# Altium schematic sheet Power.SchDoc: Main power 5V / 3V3
size A4; Date: Not used; ApprovedBy: Not used; CheckedBy: Not used; Author: Not used; CompanyName: STMicroelectronics; DrawnBy: Not used; Engineer: Not used; Organization: Not used; Address1: Not used; Address2: Not used; Address3: Not used; Address4: Not used; DocumentNumber: 6; Revision: Not used; SheetNumber: 6; SheetTotal: 8; CurrentTime: Not used; CurrentDate: Not used; Time: Not used; DocumentFullPathAndName: Not used; DocumentName: Not used; ModifiedDate: Not used; ImagePath: Not used; ProjectName: Not used; Application_BuildNumber: Not used
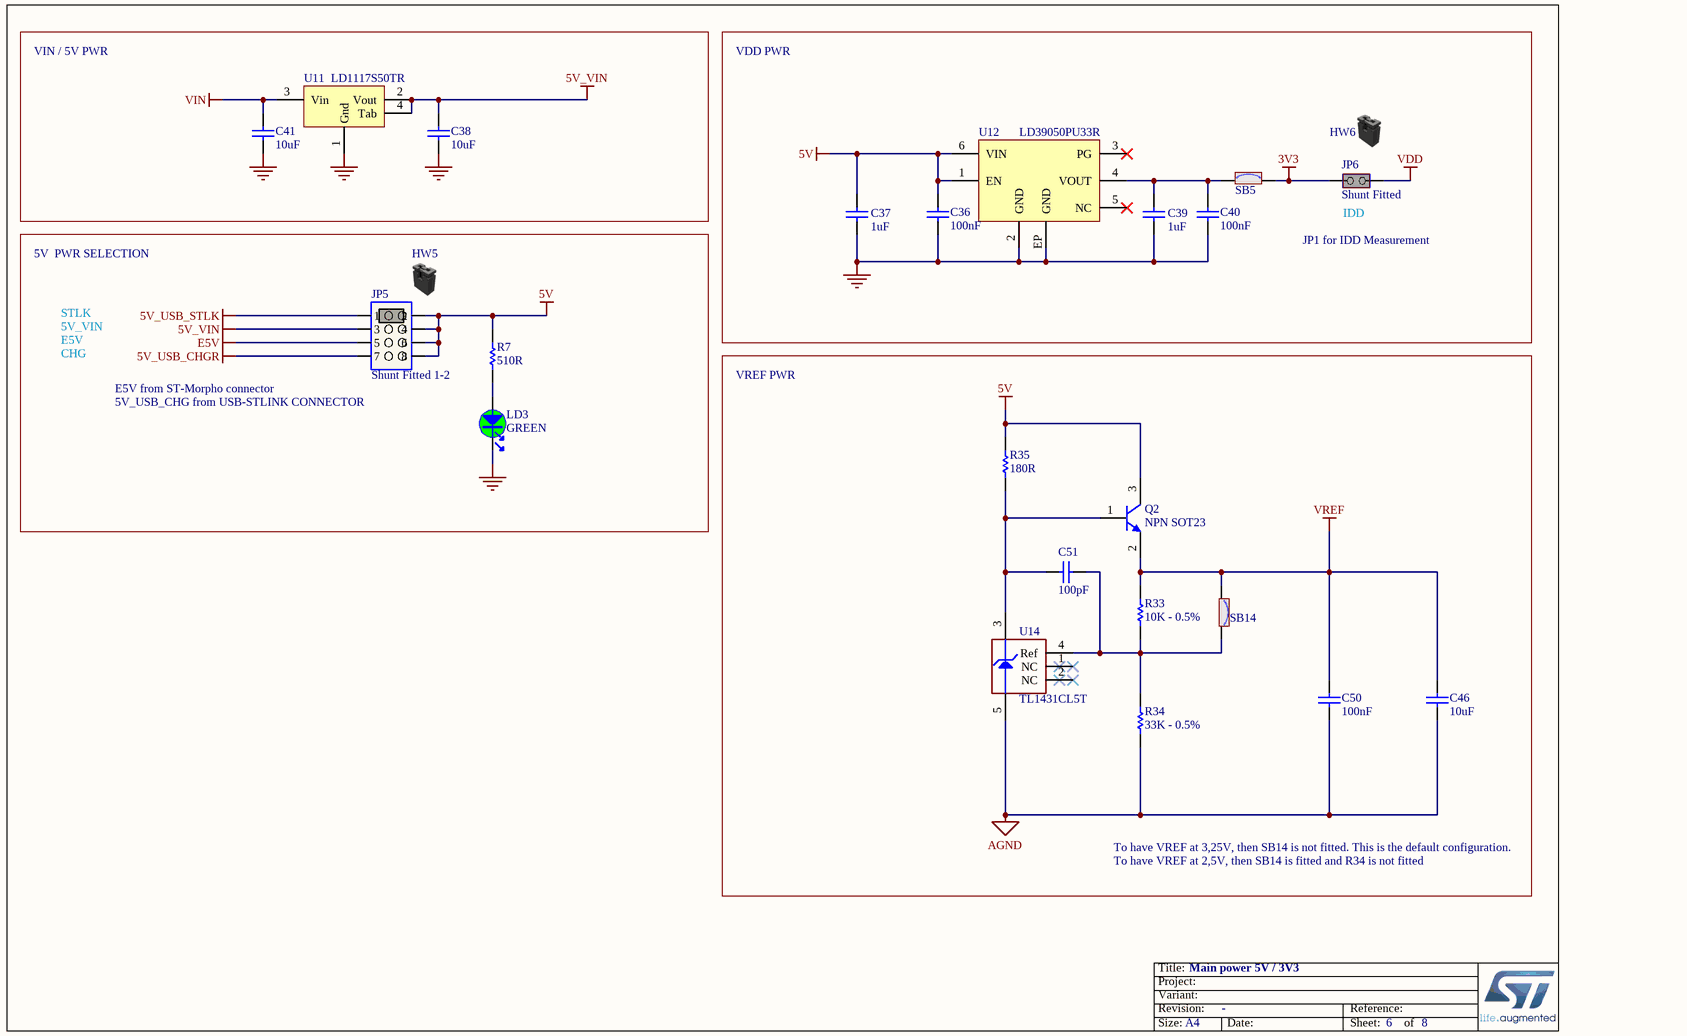
[diagram p0: Power.SchDoc]

## Parts
C36  value 100nF  [C0402]
C37  value 1uF  [C0603]
C38  value 10uF  [C0805]
C39  value 1uF  [C0603]
C40  value 100nF  [C0402]
C41  value 10uF  [C0805]
C46  value 10uF  [C0603]
C50  value 100nF  [C0603]
C51  value 100pF  [C0603]
HW5  (no value)  (mechanical)
HW6  (no value)  (mechanical)
JP5  value Shunt Fitted 1-2  [CON_SAMTEC_TSW-104-07-X-D]
JP6  Shunt Fitted  [CON_SAMTEC_TSW-102-07-G-S]
LD3  value GREEN  [LED_0603_GREEN]
Q2  value NPN SOT23  [NPN_SOT23]
R7  value 510R  [R0603]
R33  value 10K - 0.5%  [R0603]
R34  value 33K - 0.5%  [R0603]
R35  value 180R  [R0603]
SB5  (no value)  [SOLDER-BRIDGE_R0603-0R]
SB14  (no value)  [SOLDER-BRIDGE_R0603-0R]
U11  value LD1117S50TR  [REG_SOT223-TAB]
U12  value LD39050PU33R  [ICC_DFN6-EPAD_3X3_P095]
U14  value TL1431CL5T  [ICC_SOT23-5L_H1P45]

## Blocks framed on the sheet
VIN / 5V PWR: C38 C41 U11
VREF PWR: C46 C50 C51 Q2 R33-R35 SB14 U14

## Nets
3V3: JP6.1(COMMON) SB5.2
5V: C36.2 C37.2 JP5.2 JP5.4 JP5.6 JP5.8 Q2.3(C) R7.2 R35.2 U12.1(EN) U12.6(VIN)
5V_USB_CHGR: JP5.7
5V_USB_STLK: JP5.1
5V_VIN: C38.2 JP5.3 U11.2(Vout) U11.4(Tab)
AGND: C46.1 C50.1 R34.1 U14.5(Anode)
E5V: JP5.5
GND: C36.1 C37.1 C38.1 C39.1 C40.1 C41.1 LD3.2 U11.1(Gnd) U12.2(GND) U12.EP(GND)
VDD: JP6.2(NO)
VIN: C41.2 U11.3(Vin)
VREF: C46.2 C50.2 Q2.2(E) R33.2 SB14.1
NetC39_2: C39.2 C40.2 SB5.1 U12.4(VOUT)
NetC51_1: C51.1 Q2.1(B) R35.1 U14.3(Cathode)
NetC51_2: C51.2 R33.1 R34.2 SB14.2 U14.4(Ref)
NetLD3_1: LD3.1 R7.1

Not connected (* = marked no-connect by the designer): U12 3(PG)* 5(NC)*; U14 1(NC)* 2(NC)*

## Notes on the sheet
- VDD PWR
- JP1 for IDD Measurement
- (near JP6) IDD
- 5V  PWR SELECTION
- STLK
- E5V
- 5V_VIN
- CHG
- E5V from ST-Morpho connector
- 5V_USB_CHG from USB-STLINK CONNECTOR
- To have VREF at 3,25V, then SB14 is not fitted. This is the default configuration.
- To have VREF at 2,5V, then SB14 is fitted and R34 is not fitted
- Title:
- Project:
- Size:
- Revision:
- Variant:
- A4
- -
- Date:
- Reference:
- Sheet:
- of

## Library data of the parts
C36 C40 = MCD-00102: Capacitor, MLCC, 100nF, 16V, X7R, 10%, 0402, T=0,5mm; Manufacturer_Part_Number: CC0402KRX7R7BB104; Manufacturer: YAGEO; Provided_By: Subcon; Initial_Board_Reference: MB1262; Internal_Part_Number: MCD-00102; Status: Released; Package: C0402; ComponentLink1Description: Yageo_Capacitor_X7R-series.pdf; ECCN_US: n/a; ECCN_EU: n/a; Part_Type: Capacitor; ComponentLink1URL: http://tunmcdsvn.tun.st.com/Component_Datasheet_Library/Trunk/Capacitors/Yageo_Multilayer_Capacitor_X7R_series_100pF_to_22uF
C37 C39 = MCD-00010: Capacitor, MLCC, 1uF, 16V, X5R, 10%, 0603, T=0,8mm; Manufacturer_Part_Number: CC0603KRX5R7BB105; Manufacturer: YAGEO; Provided_By: Subcon; Initial_Board_Reference: MB1274; Internal_Part_Number: MCD-00010; Status: Released; Package: C0603; ComponentLink1Description: Yageo_Capacitor_X5R-series.pdf; ECCN_US: n/a; ECCN_EU: n/a; Part_Type: Capacitor; ComponentLink1URL: http://tunmcdsvn.tun.st.com/Component_Datasheet_Library/Trunk/Capacitors/Yageo_Multilayer_capacitor_X5R_series_100pF_to_100uF
C38 C41 = MCD-00014: Capacitor, MLCC, 10uF, 25V, X5R, 10%, 0805, T=0,85mm; Manufacturer_Part_Number: CC0805KRX5R8BB106; Manufacturer: YAGEO; ECCN_US: EAR99; ECCN_EU: NEC; Provided_By: SUBCO; Internal_Part_Number: MCD-00014; ComponentLink1Description: Datasheet; Status: Released; Part_Type: Capacitor; Package: C0805; ComponentLink1URL: http://tunmcdsvn.tun.st.com/Component_Datasheet_Library/Trunk/Capacitors/Yageo_Multilayer_capacitor_X5R_series_100pF_to_100uF
C46 = MCD-01124: Capacitor, MLCC, 10uF, 10V, X5R, 10%, 0603, T=0.8mm; Manufacturer_Part_Number: GRM188R61A106KAAL; Manufacturer: MURATA; ECCN_US: EAR99; ECCN_EU: NEC; Provided_By: SUBCO; Internal_Part_Number: MCD-01124; Status: Released; Part_Type: Capacitor; Package: C0603; ComponentLink1Description: Datasheet; ComponentLink1URL: http://tunmcdsvn.tun.st.com/Component_Datasheet_Library/Trunk/Capacitors/Murata_Capacitor_GR_series
C50 = MCD-00211: Capacitor, MLCC, 100nF, 16V, X7R, 10%, 0603, T=0,8mm; Manufacturer_Part_Number: CC0603KRX7R7BB104; Manufacturer: YAGEO; ECCN_US: EAR99; ECCN_EU: NEC; Provided_By: SUBCO; Internal_Part_Number: MCD-00211; Status: Released; Part_Type: Capacitor; Package: C0603; ComponentLink1Description: Datasheet; ComponentLink1URL: http://tunmcdsvn.tun.st.com/Component_Datasheet_Library/Trunk/Capacitors/Yageo_Multilayer_Capacitor_X7R_series_100pF_to_22uF
C51 = MCD-01101: Capacitor,100pF,50V,X7R,10%,0603; Manufacturer_Part_Number: 06035C101JAT4A; Manufacturer: AVX; ECCN_US: EAR99; ECCN_EU: NEC; Provided_By: SUBCO; Internal_Part_Number: MCD-01101; Status: Checked; Part_Type: Capacitor; Package: C0603; ComponentLink1Description: Datasheet; ComponentLink1URL: http://tunmcdsvn.tun.st.com/Component_Datasheet_Library/Trunk/Capacitors/AVX_Capacitor_X7R-series/AVX_X7R-series.pdf; Alternate_Manufacturer_Part_Number: N/A; Alternate_Manufacturer: N/A; Order_Code_Digikey: 06035C101JAT4A-ND; Order_Code_Farnell: N/A; Order_Code_RS: N/A; BMS_Part_Number: N/A
HW5 HW6 = MCD-00043: SHUNT 2.54mm BLACK; Manufacturer_Part_Number: SNT-100-BK-G; Manufacturer: SAMTEC; Part_Type: Mechanical; Provided_By: Subcon; Initial_Board_Reference: MB1274; Internal_Part_Number: MCD-00043; ECCN_US: n/a; ECCN_EU: n/a; ComponentLink1Description: Samtec_Shunt_Jumper_SNT100.pdf; Status: Released; ComponentLink1URL: http://tunmcdsvn.tun.st.com/Component_Datasheet_Library/Trunk/Connectors/Samtec_Shunt_Jumper_SNT100
JP5 = MCD-00686: Header, 4x2, 2,54mm, VR, TH, Height 5.84mm/2.54mm - Shunt Fitted 1-2; Part_Type: Connector; Manufacturer_Part_Number: TSW-104-07-x-D; Manufacturer: SAMTEC; Provided_By: SUBCO; Internal_Part_Number: MCD-00686; Status: Released; ComponentLink1Description: Datasheet; ComponentLink1URL: http://tunmcdsvn.tun.st.com/Component_Datasheet_Library/Trunk/Connectors/Samtec_TSW-HTSW-series; ECCN_US: n/a; ECCN_EU: n/a
JP6 = MCD-00683: Header, 2x1, 2,54mm, VR, TH, Height 5.84mm/2.54mm - Shunt Fitted by default; Part_Type: Connector; Manufacturer_Part_Number: TSW-102-07-x-S; Manufacturer: SAMTEC; Provided_By: Subcon; Initial_Board_Reference: MB1331; Internal_Part_Number: MCD-00683; Value: Shunt Fitted; Status: Released; ComponentLink1Description: Samtec_connector_TSW-HTSW-series.pdf; ComponentLink1URL: http://tunmcdsvn.tun.st.com/Component_Datasheet_Library/Trunk/Connectors/Samtec_TSW-HTSW-series; ECCN_US: n/a; ECCN_EU: n/a
LD3 = MCD-00050: LED, Green, 0603; Manufacturer_Part_Number: 19-213SYGC/S530-E2/TR8; Manufacturer: EVERLIGHT; Part_Type: Display; ECCN_US: EAR99; ECCN_EU: NEC; Provided_By: SUBCO; Internal_Part_Number: MCD-00050; ComponentLink1Description: Datasheet; Status: Released; ComponentLink1URL: http://tunmcdsvn.tun.st.com/Component_Datasheet_Library/Trunk/Display/Everlight_SMD-LED-GREEN_19-213SYGC-S530-XX-TR8-v3.doc; Package: LED 0603
Q2 = MCD-00073: NPN Bipolar Transistor; Part_Type: IC; Manufacturer_Part_Number: BSR14; Manufacturer: ON SEMICONDUCTOR; Alternate_Manufacturer_Part_Number: MMBT2222LT1G / MMBT2222ALT1G / MMBT2222ALT3G; ECCN_US: EAR99; ECCN_EU: NEC; Provided_By: SUBCO; Revision: *; Internal_Part_Number: MCD-00073; Status: Released; ComponentLink1Description: Datasheet; ComponentLink1URL: http://tunmcdsvn.tun.st.com/Component_Datasheet_Library/Trunk/IC/NXP_Transistor_BSR14; Alternate_Manufacturer: ON SEMICONDUCTOR; Package: SOT23
R7 = MCD-00225: Resistor,510R,0603,1%,1/10W; Manufacturer_Part_Number: RC0603FR-07510RL; Manufacturer: YAGEO; ECCN_US: EAR99; ECCN_EU: NEC; Provided_By: SUBCO; Internal_Part_Number: MCD-00225; ComponentLink1Description: Datasheet; Status: Released; Part_Type: Resistor; Package: R0603; ComponentLink1URL: http://tunmcdsvn.tun.st.com/Component_Datasheet_Library/Trunk/Resistors/Yageo_Resistor_RC0603-series
R33 = MCD-01215: resistor, 10K, 0603, 0.5%, 1/10W; Manufacturer_Part_Number: RC0603DR-0710KL; Manufacturer: YAGEO; ECCN_US: EAR99; ECCN_EU: NEC; Provided_By: SUBCO; Internal_Part_Number: MCD-01215; Status: Checked; Part_Type: Resistor; Package: R0603; ComponentLink1Description: Datasheet; ComponentLink1URL: http://tunmcdsvn.tun.st.com/Component_Datasheet_Library/Trunk/Resistors/Yageo_Resistor_RC0603-series/RC_Group_51_RoHS_L_7.pdf
R34 = MCD-01209: Resistor,33K,0603,0.5%,1/10W; Manufacturer_Part_Number: RC0603DR-0733KL; Manufacturer: YAGEO; ECCN_US: EAR99; ECCN_EU: NEC; Provided_By: SUBCO; Internal_Part_Number: MCD-01209; Status: Checked; Part_Type: Resistor; Package: R0603; ComponentLink1Description: Datasheet; ComponentLink1URL: http://tunmcdsvn.tun.st.com/Component_Datasheet_Library/Trunk/Resistors/Yageo_Resistor_RC0603-series/RC_Group_51_RoHS_L_7.pdf
R35 = MCD-00342: Resistor,180R,0603,1%,1/10W; Manufacturer_Part_Number: RC0603FR-07180RL; Manufacturer: YAGEO; ECCN_US: EAR99; ECCN_EU: NEC; Provided_By: SUBCO; Internal_Part_Number: MCD-00342; Status: Released; Part_Type: Resistor; Package: R0603; ComponentLink1Description: Datasheet; ComponentLink1URL: http://tunmcdsvn.tun.st.com/Component_Datasheet_Library/Trunk/Resistors/Yageo_Resistor_RC0603-series
SB5 SB14 = MCD-00071: Solder Bridge ON; Part_Type: Mechanical; Manufacturer_Part_Number: RC0603JR-070RL; Manufacturer: YAGEO; Provided_By: SUBCO; Internal_Part_Number: MCD-00071; ECCN_US: n/a; ECCN_EU: n/a; Status: Released; Package: SB0603; ComponentLink1Description: Datasheet; ComponentLink1URL: http://tunmcdsvn.tun.st.com/Component_Datasheet_Library/Trunk/Resistors/Yageo_Resistor_RC0603-series
U11 = MCD-00088: IC REG LDO 5V 0.8A SOT223; Manufacturer: STMICROELECTRONICS; BMS_Part_Number: 9176133; ECCN_US: EAR99; ECCN_EU: NEC; Provided_By: SUBCO with ST control; Internal_Part_Number: MCD-00088; Manufacturer_Part_Number: LD1117S50TR; ComponentLink1Description: Datasheet; Status: Released; Part_Type: IC; ComponentLink1URL: http://tunmcdsvn.tun.st.com/Component_Datasheet_Library/Trunk/IC/STM_LDO_LD1117; Package: SOT-223
U12 = MCD-00215: Low quiescent current and low noise voltage regulators; Manufacturer: STMICROELECTRONICS; Part_Type: IC; BMS_Part_Number: 9176126; ECCN_US: EAR99; ECCN_EU: NEC; Provided_By: SUBCO with ST control; Internal_Part_Number: MCD-00215; Manufacturer_Part_Number: LD39050PU33R; Status: Released; ComponentLink1Description: Datasheet; ComponentLink1URL: http://tunmcdsvn.tun.st.com/Component_Datasheet_Library/Trunk/IC/STM_LDO_LD39050PU; Package: DFN6 3x3mm
U14 = MCD-01802: Programmable voltage reference with 0.4% voltage precision; Part_Type: IC; Manufacturer: STMICROELECTRONICS; BMS_Part_Number: 9176334; ECCN_US: EAR99; ECCN_EU: NEC; Provided_By: SUBCO with ST control; Internal_Part_Number: MCD-01802; Status: Footprint available; Manufacturer_Part_Number: TL1431CL5T; Package: SOT23-5L; ComponentLink1Description: Datasheet; ComponentLink1URL: http://tunmcdsvn.tun.st.com/Component_Datasheet_Library/Trunk/IC/STM_voltage_reference_TL1431ACL5T/